# EAGLE design 4-bit-module (EAGLE 8.3.1)
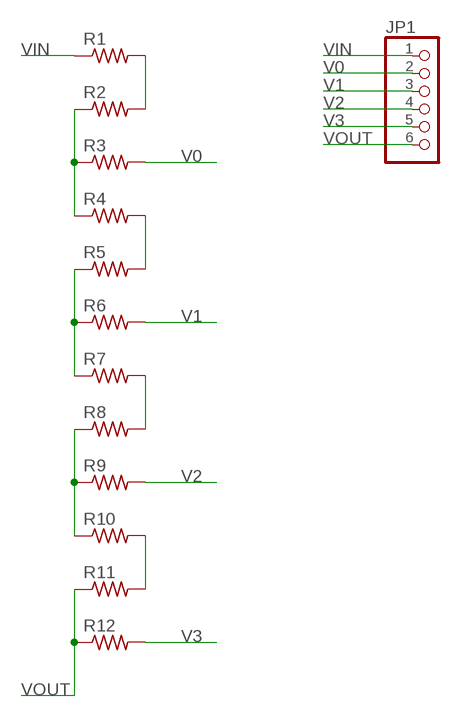
[diagram p0: schematic, sheet 1]

## Parts
JP1  PINHD-1X6/90  [1X06/90]
R1  R-US_0204/7  [0204/7]
R2  R-US_0204/7  [0204/7]
R3  R-US_0204/7  [0204/7]
R4  R-US_0204/7  [0204/7]
R5  R-US_0204/7  [0204/7]
R6  R-US_0204/7  [0204/7]
R7  R-US_0204/7  [0204/7]
R8  R-US_0204/7  [0204/7]
R9  R-US_0204/7  [0204/7]
R10  R-US_0204/7  [0204/7]
R11  R-US_0204/7  [0204/7]
R12  R-US_0204/7  [0204/7]

## Nets
N$1: R1.2 R2.2
N$2: R2.1 R3.1 R4.1
N$3: R4.2 R5.2
N$4: R5.1 R6.1 R7.1
N$6: R7.2 R8.2
N$7: R8.1 R9.1 R10.1
N$9: R10.2 R11.2
V0: JP1.2 R3.2
V1: JP1.3 R6.2
V2: JP1.4 R9.2
V3: JP1.5 R12.2
VIN: JP1.1 R1.1
VOUT: JP1.6 R11.1 R12.1

## Library data of the parts
JP1 = pinhead:PINHD-1X6: PIN HEADER
R1-R12 = resistor:R-US_: RESISTOR, American symbol

## Board
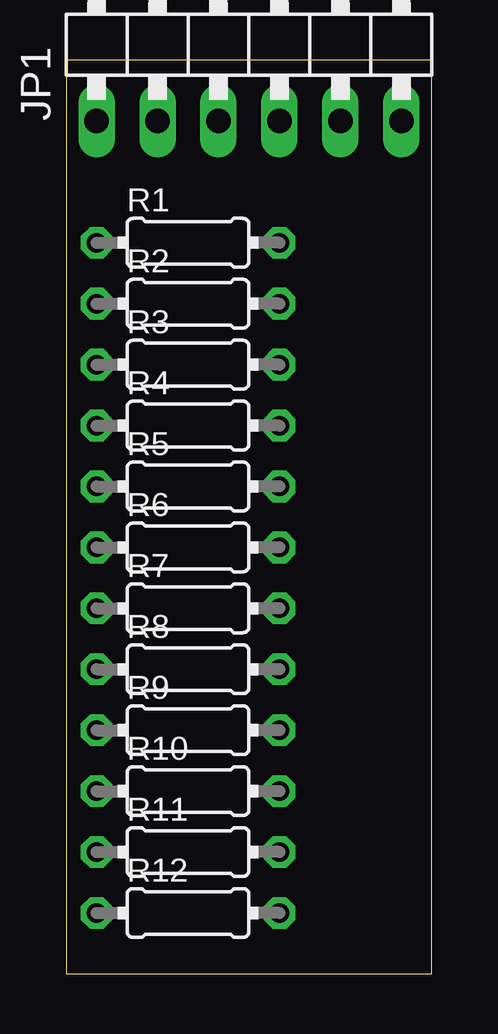
[diagram p1: board, top side]
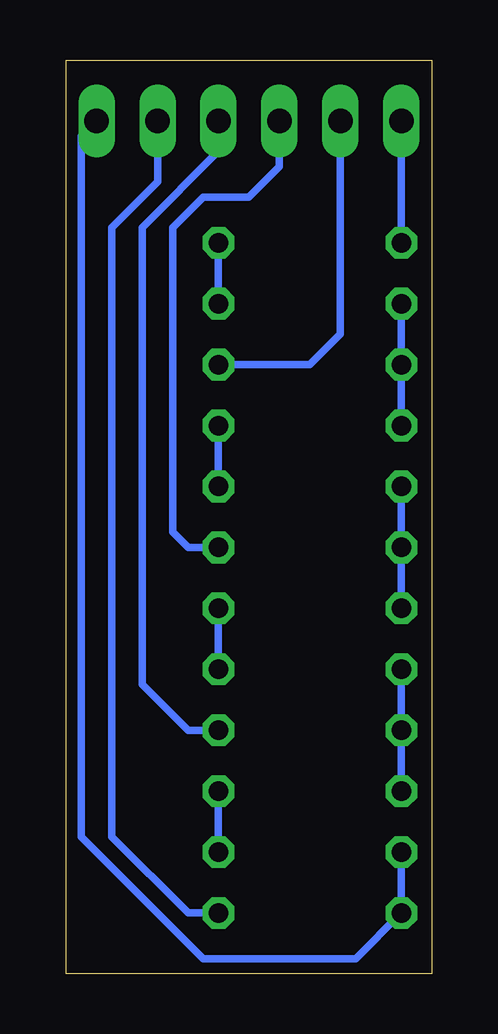
[diagram p2: board, bottom side, seen from below]

Size 15.24 x 38.1 mm. Coordinates in mm from the lower left corner, seen from the top.
Outline: 0,0 15.24,0 15.24,38.1 0,38.1 0,0
Copper layers (1*16): Top 0.035mm / dielectric 1.5mm / Bottom 0.035mm
Design rules "default *": minimum track width 6mil, minimum drill 0.35mm, track to track 12mil, track to pad 24mil, pad to pad 24mil, via to via 12mil, smd to smd 6mil, copper to edge 40mil, drill to drill 6mil, minimum pad ring 10mil, minimum via ring 8mil, stop-mask expansion 4mil, vias tented up to drill 0mil, thermal gap 10mil

### Footprints (pad centres in the part's own frame; a part is rotated, then mirrored left to right if it is on the bottom)
1X06/90 = drill 1.016 long: 1 -6.35,-3.81; 2 -3.81,-3.81; 3 -1.27,-3.81; 4 1.27,-3.81; 5 3.81,-3.81; 6 6.35,-3.81
0204/7 = drill 0.813 octagon: 1 -3.81,0; 2 3.81,0

### Placement (x,y rotation side)
JP1  7.62,39.37 0 top
R1  5.08,30.48 0 top
R2  5.08,27.94 0 top
R3  5.08,25.4 0 top
R4  5.08,22.86 0 top
R5  5.08,20.32 0 top
R6  5.08,17.78 0 top
R7  5.08,15.24 0 top
R8  5.08,12.7 0 top
R9  5.08,10.16 0 top
R10  5.08,7.62 0 top
R11  5.08,5.08 0 top
R12  5.08,2.54 0 top

### Tracks (layer width: path | path; a pad name or v marks a point on that pad's centre or on a via)
N$1
  Bottom 0.305: R1.2 R2.2
N$2
  Bottom 0.305: R2.1 R3.1 R4.1
N$3
  Bottom 0.305: R4.2 R5.2
N$4
  Bottom 0.305: R5.1 R6.1 R7.1
N$6
  Bottom 0.305: R7.2 R8.2
N$7
  Bottom 0.305: R8.1 R9.1 R10.1
N$9
  Bottom 0.305: R10.2 R11.2
V0
  Bottom 0.305: R3.2 5.08,25.4 3.81,26.67 JP1.2
V1
  Bottom 0.305: JP1.3 6.35,33.66 7.62,32.38 9.52,32.38 10.79,31.12 10.79,18.41 10.16,17.78 R6.2
V2
  Bottom 0.305: JP1.4 8.89,34.29 12.06,31.12 12.06,12.06 10.16,10.16 R9.2
V3
  Bottom 0.305: JP1.5 11.43,33.02 13.33,31.12 13.33,5.71 10.16,2.54 R12.2
VIN
  Bottom 0.305: JP1.1 R1.1
VOUT
  Bottom 0.305: R11.1 R12.1 3.17,0.63 9.52,0.63 14.61,5.71 14.61,34.92 JP1.6